# Altium schematic sheet Connector.SchDoc
size A3; SheetNumber: 1; SheetTotal: 9
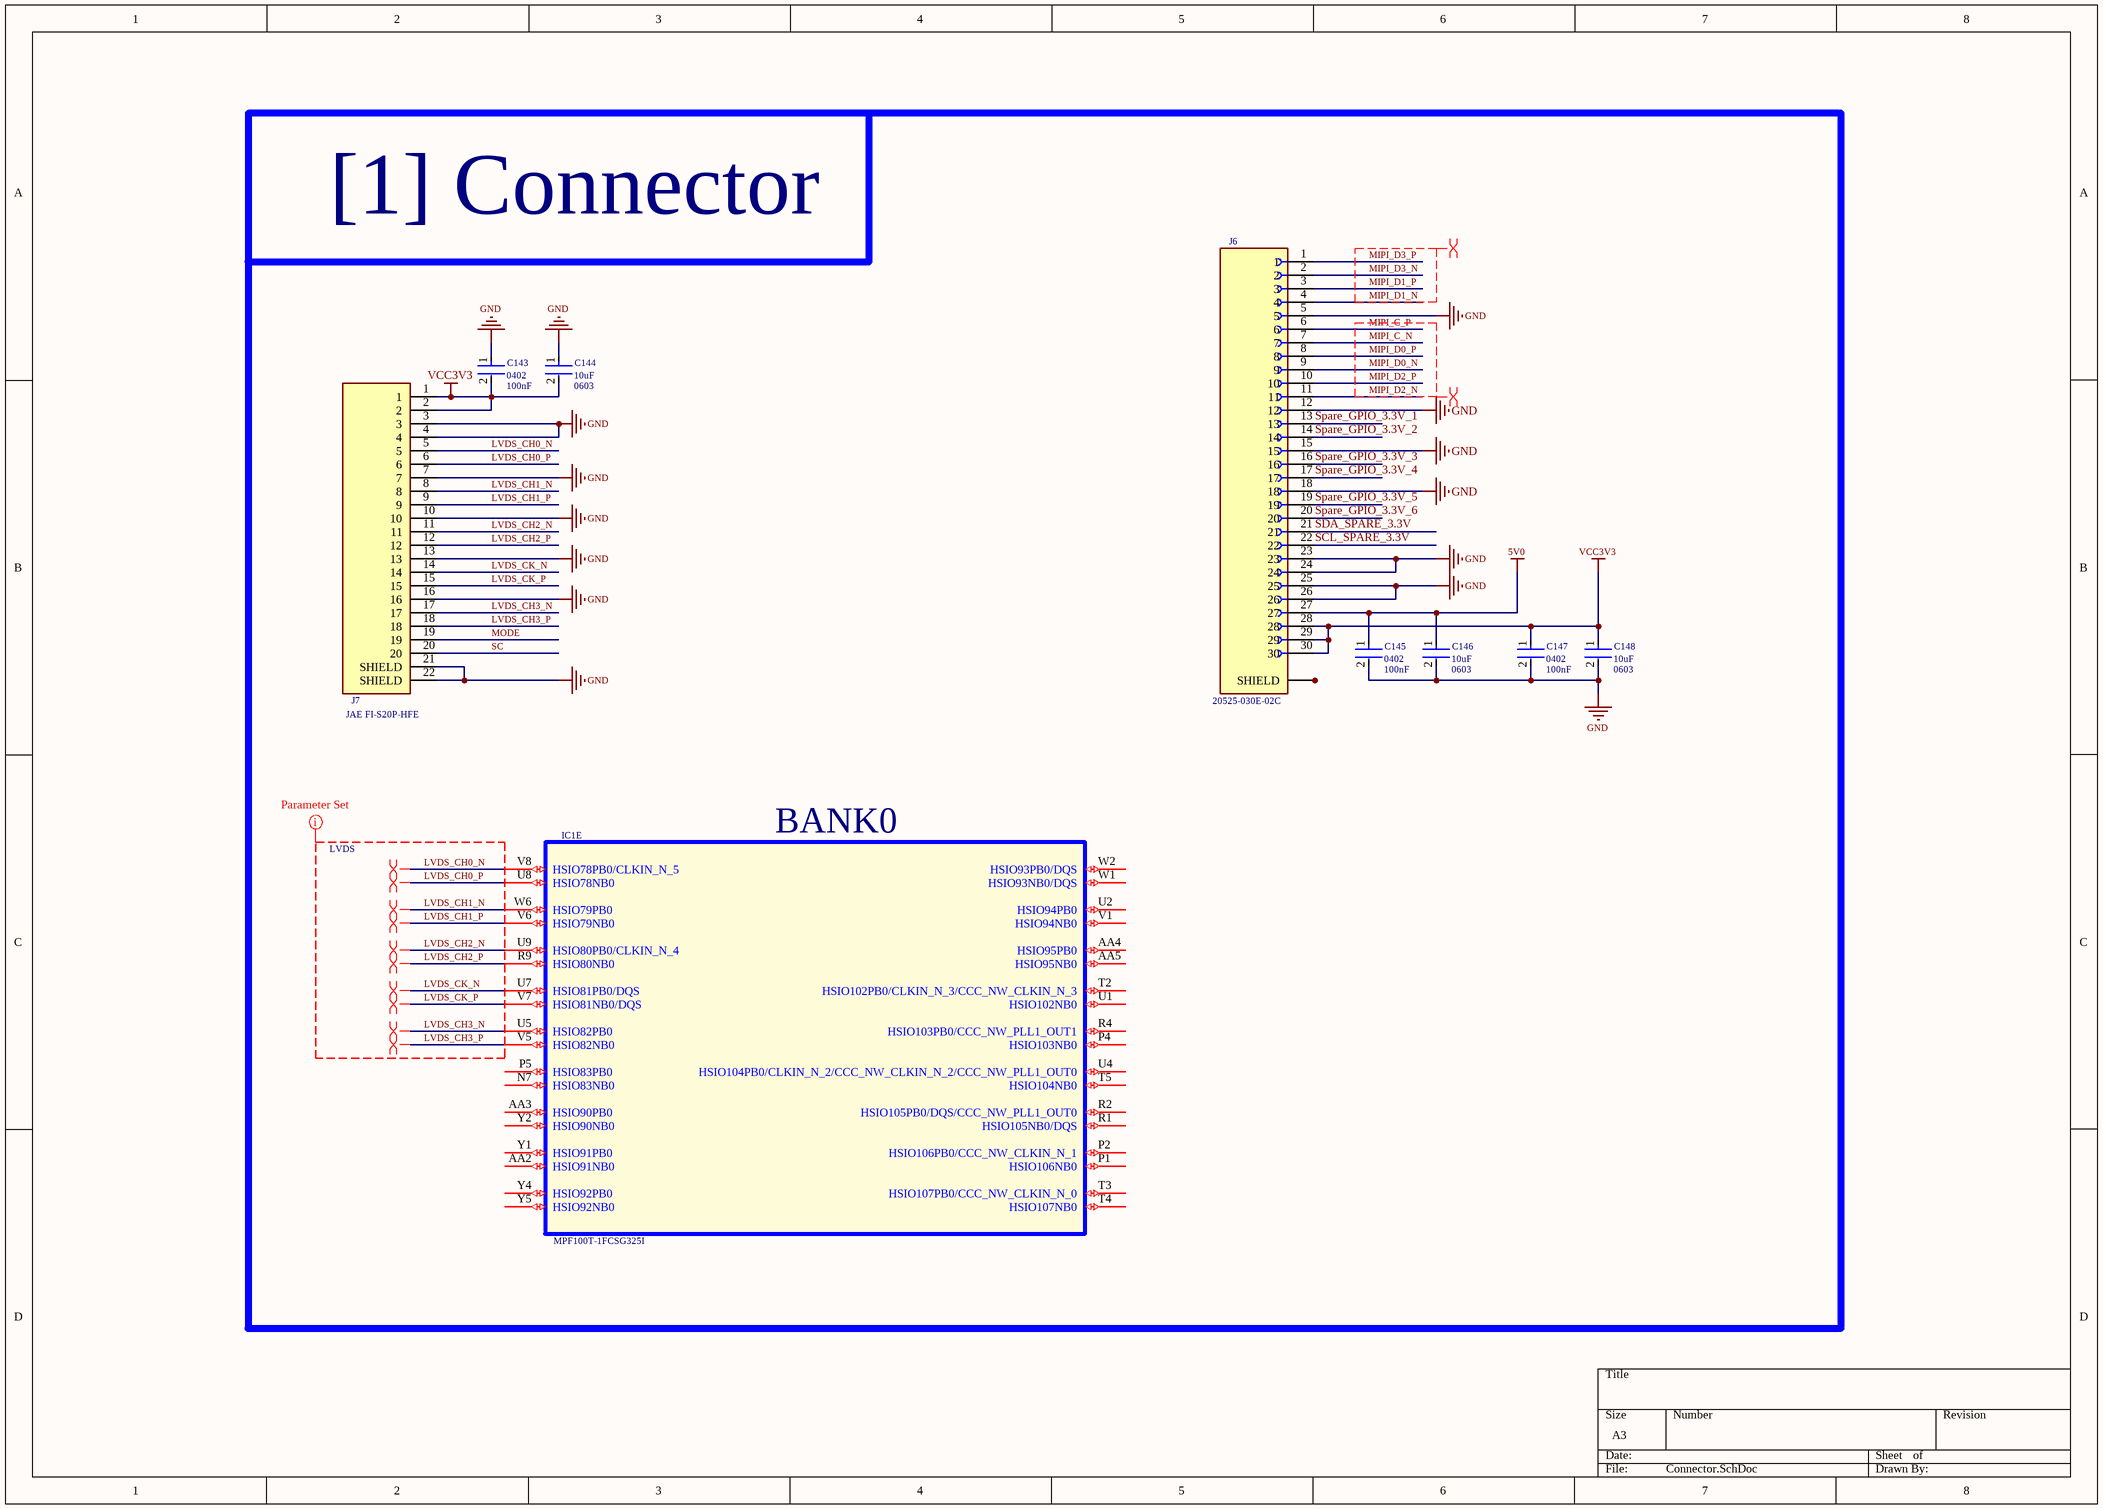
[diagram p0: Connector.SchDoc]

## Parts
C143  Package: 0402  Capacitance: 100nF  [FP-C0402-BB-MFG]  (hidden comment: C0402C104K8PACTU)
C144  Capacitance: 10uF  Case/Package: 0603  [FP-GRM188-0_1-e0_2_0_55-IPC_A]  (hidden comment: GRM188R60J106ME47D)
C145  Package: 0402  Capacitance: 100nF  [FP-C0402-BB-MFG]  (hidden comment: C0402C104K8PACTU)
C146  Capacitance: 10uF  Case/Package: 0603  [FP-GRM188-0_1-e0_2_0_55-IPC_A]  (hidden comment: GRM188R60J106ME47D)
C147  Package: 0402  Capacitance: 100nF  [FP-C0402-BB-MFG]  (hidden comment: C0402C104K8PACTU)
C148  Capacitance: 10uF  Case/Package: 0603  [FP-GRM188-0_1-e0_2_0_55-IPC_A]  (hidden comment: GRM188R60J106ME47D)
IC1  MPF100T-1FCSG325I  [MPF100T-1FCSG325I]  (part E of 9)
J6  20525-030E-02C  [I-PEX_20525-030E-02C]
J7  JAE FI-S20P-HFE  [JAE FI-S20P-HFE]

## Blocks framed on the sheet
[1] Connector: C143-C148 IC1 J6 J7

## Nets
5V0: C145.1 C146.1 J6.27
GND: C143.1 C144.1 C145.2 C146.2 C147.2 C148.2 J6.5 J6.12 J6.15 J6.18 J6.23 J6.24 J6.25 J6.26 J7.3 J7.4 J7.7 J7.10 J7.13 J7.16 J7.21(SHIELD) J7.22(SHIELD)
VCC3V3: C143.2 C144.2 C147.1 C148.1 J6.28 J6.29 J6.30 J7.1 J7.2
LVDS_CH0_N: IC1.V8(HSIO78PB0/CLKIN_N_5) J7.5
LVDS_CH0_P: IC1.U8(HSIO78NB0) J7.6
LVDS_CH1_N: IC1.W6(HSIO79PB0) J7.8
LVDS_CH1_P: IC1.V6(HSIO79NB0) J7.9
LVDS_CH2_N: IC1.U9(HSIO80PB0/CLKIN_N_4) J7.11
LVDS_CH2_P: IC1.R9(HSIO80NB0) J7.12
LVDS_CH3_N: IC1.U5(HSIO82PB0) J7.17
LVDS_CH3_P: IC1.V5(HSIO82NB0) J7.18
LVDS_CK_N: IC1.U7(HSIO81PB0/DQS) J7.14
LVDS_CK_P: IC1.V7(HSIO81NB0/DQS) J7.15
MIPI_C_N: J6.7
MIPI_C_P: J6.6
MIPI_D0_N: J6.9
MIPI_D0_P: J6.8
MIPI_D1_N: J6.4
MIPI_D1_P: J6.3
MIPI_D2_N: J6.11
MIPI_D2_P: J6.10
MIPI_D3_N: J6.2
MIPI_D3_P: J6.1
MODE: J7.19
SC: J7.20
SCL_SPARE_3.3V: J6.22
SDA_SPARE_3.3V: J6.21
Spare_GPIO_3.3V_1: J6.13
Spare_GPIO_3.3V_2: J6.14
Spare_GPIO_3.3V_3: J6.16
Spare_GPIO_3.3V_4: J6.17
Spare_GPIO_3.3V_5: J6.19
Spare_GPIO_3.3V_6: J6.20
NetJ6_P1: J6.P1(SHIELD) J6.P2(SHIELD) J6.P3(SHIELD) J6.P4(SHIELD) J6.P5(SHIELD) J6.P6(SHIELD) J6.P7(SHIELD) J6.P8(SHIELD) J6.P9(SHIELD) J6.P10(SHIELD) J6.P11(SHIELD)

Not connected (* = marked no-connect by the designer): IC1 AA2(HSIO91NB0) AA3(HSIO90PB0) AA4(HSIO95PB0) AA5(HSIO95NB0) N7(HSIO83NB0) P1(HSIO106NB0) P2(HSIO106PB0/CCC_NW_CLKIN_N_1) P4(HSIO103NB0) P5(HSIO83PB0) R1(HSIO105NB0/DQS) R2(HSIO105PB0/DQS/CCC_NW_PLL1_OUT0) R4(HSIO103PB0/CCC_NW_PLL1_OUT1) T2(HSIO102PB0/CLKIN_N_3/CCC_NW_CLKIN_N_3) T3(HSIO107PB0/CCC_NW_CLKIN_N_0) T4(HSIO107NB0) T5(HSIO104NB0) U1(HSIO102NB0) U2(HSIO94PB0) U4(HSIO104PB0/CLKIN_N_2/CCC_NW_CLKIN_N_2/CCC_NW_PLL1_OUT0) V1(HSIO94NB0) W1(HSIO93NB0/DQS) W2(HSIO93PB0/DQS) Y1(HSIO91PB0) Y2(HSIO90NB0) Y4(HSIO92PB0) Y5(HSIO92NB0)

## Layout directives
differential pair: LVDS_CH0_N, LVDS_CH0_P, LVDS_CH1_N, LVDS_CH1_P, LVDS_CH2_N, LVDS_CH2_P, LVDS_CH3_N, LVDS_CH3_P, LVDS_CK_N, LVDS_CK_P, MIPI_C_N, MIPI_C_P, MIPI_D0_N, MIPI_D0_P, MIPI_D1_N, MIPI_D1_P, MIPI_D2_N, MIPI_D2_P, MIPI_D3_N, MIPI_D3_P
net class LVDS: LVDS_CH0_N, LVDS_CH0_P, LVDS_CH1_N, LVDS_CH1_P, LVDS_CH2_N, LVDS_CH2_P, LVDS_CH3_N, LVDS_CH3_P, LVDS_CK_N, LVDS_CK_P

## Notes on the sheet
- (in symbol MPF100T-1FCSG325I, part E) BANK0

## Library data of the parts
C143 C145 C147 = CMP-2008-02046-2: CAP CER 0.1UF 10V X5R 0402; Manufacturer: Kemet; Material: Ceramic; Temperature Coefficient: 15%; Tolerance: 0.1; Value: 0.10 μF; Temperature: -55°C to +125°C; ComponentLink2Description: Datasheet; Temperature Characteristic: X5R; Device Class L1: Passive Components; Height: 0.55mm; Lead Free: Yes; ComponentLink2URL: https://content.kemet.com/datasheets/KEM_C1002_X7R_SMD.pdf; Device Class L2: Capacitors; Temperature Range Low: -55°C; Temperature Range High: +125°C; RoHS: TRUE; Octopart: https://octopart.com/c0402c104k8pactu-kemet-140039; Automotive: No; Mouser Description: Capacitor 100 nF 10 VDC 0402; Category: Cap; Voltage Rating: 10 V; Digikey Description: CAP CER 0.1UF 10V X5R 0402; Ipc Land Pattern Name: CAPC10050X50; Device Class L3: Ceramic Capacitors; Manufacturer Part Number: C0402C104K8PACTU; Manufacturer: KEMET
C144 C146 C148 = CMP-2006-02792-2: Chip Multilayer Ceramic Capacitors for General Purpose, 0603, 10uF, X5R, 15%, 20%, 6.3V; Manufacturer: Murata; Packaging: Tape and Reel; Voltage Rating (DC): 6.3V; Width: 0.031inch; Termination: SMD/SMT; Dielectric: X5R; Package Quantity: 4000; Voltage Rating: 6.3V; Min Operating Temperature: -55°C; Voltage: 6.3V; Length: 1.6mm; Thickness: 0.035inch; Lead Free: Lead Free; Depth: 0.8mm; Case Code (Imperial): 0603; Max Operating Temperature: 85°C; Material: Ceramic; Height: 0.8mm; Tolerance: 20%; Mount: Surface Mount; REACH SVHC: No SVHC; Radiation Hardening: No; Case Code (Metric): 1608; Manufacturer Part Number: GRM188R60J106ME47D
IC1 = MPF100T-1FCSG325I: Part_Number: J00001; Part_Name: Jumper; ID: 110; Mounting_Type: SMT; ComponentLink1Description: Datasheet
J6 = 20525-030E-02C: 0.4 mm pitch, Horizontal mating Micro-coaxial cable connector; MF: I-PEX; SnapEDA_Link: https://www.snapeda.com/parts/20525-030E-02C/I-PEX/view-part/?ref=snap; Availability: Not in stock; Package: Package; Check_prices: https://www.snapeda.com/parts/20525-030E-02C/I-PEX/view-part/?ref=eda; Value: *; Price: None; MP: 20525-030E-02C
J7 = JAE FI-S20P-HFE: Board-to-Cable Connector, Friction lock, connector, Standard type , 20 pos., 1.25mm pitch, Board side receptacle; Part_Number: J00001; Part_Name: Jumper; ID: 110; Mounting_Type: SMT; ComponentLink1Description: Datasheet